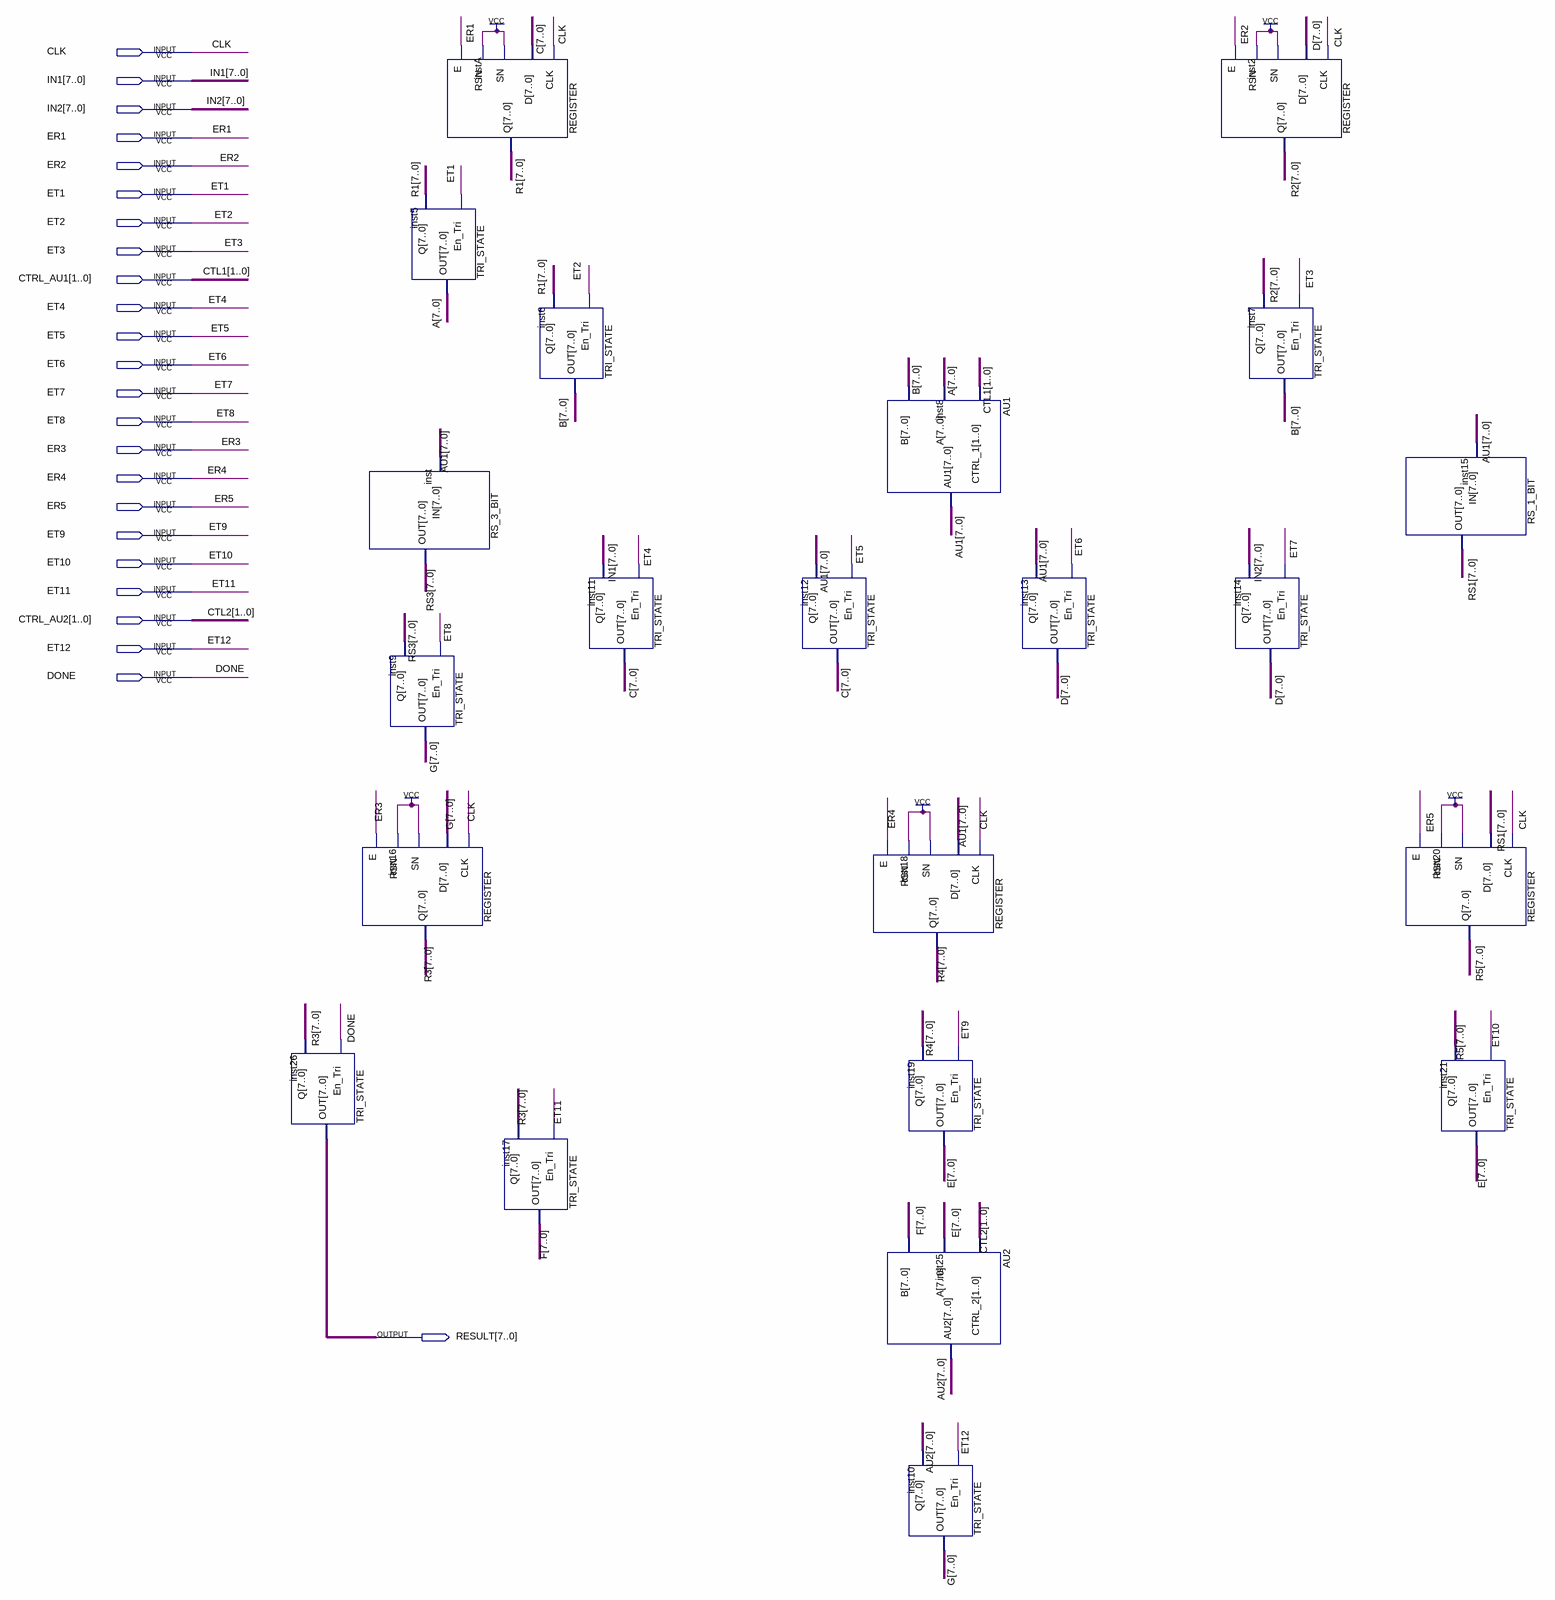
[diagram p0: schematic sheet]
// Quartus schematic Piplined_Datapath_DATAPATH.bdf as structural Verilog: 22 symbols, 24 pins
module Piplined_Datapath_DATAPATH (
  input  CLK,
  input  [7:0] IN1,
  input  [7:0] IN2,
  input  ER1,
  input  ER2,
  input  ET1,
  input  ET2,
  input  ET3,
  input  [1:0] CTRL_AU1,
  input  ET4,
  input  ET5,
  input  ET6,
  input  ET7,
  input  ET8,
  input  ER3,
  input  ER4,
  input  ER5,
  input  ET9,
  input  ET10,
  input  ET11,
  input  [1:0] CTRL_AU2,
  input  ET12,
  input  DONE,
  output [7:0] RESULT
);

  wire [7:0] A, AU1, AU2, B, C, D, E, F, G, R1, R2, R3, R4, R5, RS1, RS3;

  TRI_STATE inst26 (.En_Tri(DONE), .Q(R3), .OUT(RESULT));
  RS_3_BIT inst (.IN(AU1), .OUT(RS3));
  TRI_STATE inst9 (.En_Tri(ET8), .Q(RS3), .OUT(G));
  REGISTER inst16 (.CLK(CLK), .D(G), .SN(1'b1), .RSN(1'b1), .E(ER3), .Q(R3));
  REGISTER instA (.CLK(CLK), .D(C), .SN(1'b1), .RSN(1'b1), .E(ER1), .Q(R1));
  TRI_STATE inst5 (.En_Tri(ET1), .Q(R1), .OUT(A));
  TRI_STATE inst17 (.En_Tri(ET11), .Q(R3), .OUT(F));
  TRI_STATE inst6 (.En_Tri(ET2), .Q(R1), .OUT(B));
  TRI_STATE inst11 (.En_Tri(ET4), .Q(IN1), .OUT(C));
  TRI_STATE inst12 (.En_Tri(ET5), .Q(AU1), .OUT(C));
  AU1 inst8 (.CTRL_1(CTRL_AU1), .A(A), .B(B), .AU1(AU1));
  REGISTER inst18 (.CLK(CLK), .D(AU1), .SN(1'b1), .RSN(1'b1), .E(ER4), .Q(R4));
  AU2 inst25 (.CTRL_2(CTRL_AU2), .A(E), .B(F), .AU2(AU2));
  TRI_STATE inst19 (.En_Tri(ET9), .Q(R4), .OUT(E));
  TRI_STATE inst10 (.En_Tri(ET12), .Q(AU2), .OUT(G));
  TRI_STATE inst13 (.En_Tri(ET6), .Q(AU1), .OUT(D));
  REGISTER inst2 (.CLK(CLK), .D(D), .SN(1'b1), .RSN(1'b1), .E(ER2), .Q(R2));
  TRI_STATE inst14 (.En_Tri(ET7), .Q(IN2), .OUT(D));
  TRI_STATE inst7 (.En_Tri(ET3), .Q(R2), .OUT(B));
  RS_1_BIT inst15 (.IN(AU1), .OUT(RS1));
  REGISTER inst20 (.CLK(CLK), .D(RS1), .SN(1'b1), .RSN(1'b1), .E(ER5), .Q(R5));
  TRI_STATE inst21 (.En_Tri(ET10), .Q(R5), .OUT(E));

  // Other names for the same wires on the sheet: CTL1[1:0] = CTRL_AU1; CTL2[1:0] = CTRL_AU2
endmodule
